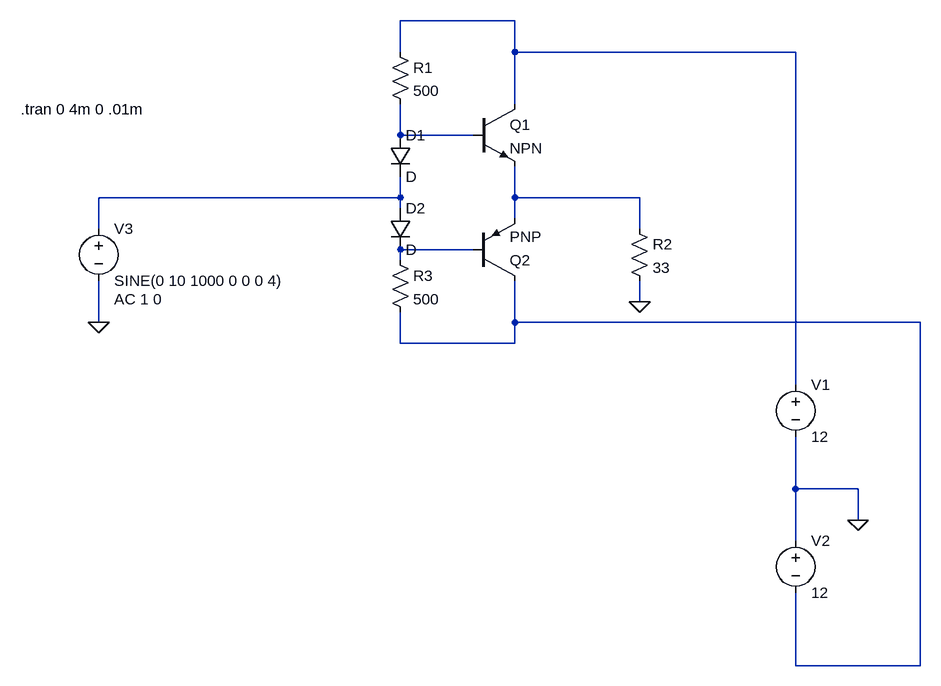
[diagram p0: schematic claseab2.asc]
claseab2.asc, the LTspice schematic file:
Version 4
SHEET 1 1360 680
WIRE 256 -560 80 -560
WIRE 80 -512 80 -560
WIRE 256 -512 256 -560
WIRE 688 -512 256 -512
WIRE 256 -432 256 -512
WIRE 80 -384 80 -432
WIRE 192 -384 80 -384
WIRE 80 -288 80 -320
WIRE 80 -288 -384 -288
WIRE 256 -288 256 -336
WIRE 448 -288 256 -288
WIRE 80 -272 80 -288
WIRE 256 -256 256 -288
WIRE -384 -240 -384 -288
WIRE 448 -240 448 -288
WIRE 192 -208 80 -208
WIRE 80 -192 80 -208
WIRE 448 -128 448 -160
WIRE -384 -96 -384 -160
WIRE 256 -96 256 -160
WIRE 880 -96 256 -96
WIRE 80 -64 80 -112
WIRE 256 -64 256 -96
WIRE 256 -64 80 -64
WIRE 688 0 688 -512
WIRE 688 160 688 80
WIRE 784 160 688 160
WIRE 784 208 784 160
WIRE 688 240 688 160
WIRE 688 432 688 320
WIRE 880 432 880 -96
WIRE 880 432 688 432
FLAG 784 208 0
FLAG -384 -96 0
FLAG 448 -128 0
SYMBOL voltage 688 -16 R0
WINDOW 123 0 0 Left 2
WINDOW 39 0 0 Left 2
SYMATTR InstName V1
SYMATTR Value 12
SYMBOL voltage 688 224 R0
WINDOW 123 0 0 Left 2
WINDOW 39 0 0 Left 2
SYMATTR InstName V2
SYMATTR Value 12
SYMBOL voltage -384 -256 R0
WINDOW 123 24 124 Left 2
WINDOW 39 0 0 Left 2
SYMATTR Value2 AC 1 0
SYMATTR InstName V3
SYMATTR Value SINE(0 10 1000 0 0 0 4)
SYMBOL diode 64 -384 R0
SYMATTR InstName D1
SYMBOL diode 64 -272 R0
SYMATTR InstName D2
SYMBOL res 432 -256 R0
SYMATTR InstName R2
SYMATTR Value 33
SYMBOL res 64 -528 R0
SYMATTR InstName R1
SYMATTR Value 500
SYMBOL res 64 -208 R0
SYMATTR InstName R3
SYMATTR Value 500
SYMBOL npn 192 -432 R0
SYMATTR InstName Q1
SYMBOL pnp 192 -160 M180
SYMATTR InstName Q2
TEXT -504 -424 Left 2 !.tran 0 4m 0 .01m

The netlist it stands for:
* claseab2.asc
V1 N001 0 12
V2 0 N006 12
V3 N003 0 SINE(0 10 1000 0 0 0 4) AC 1 0
D1 N002 N003 D
D2 N003 N005 D
R2 N004 0 33
R1 N001 N002 500
R3 N005 N006 500
Q1 N001 N002 N004 0 NPN
Q2 N006 N005 N004 0 PNP
.model D D
.lib standard.dio
.model NPN NPN
.model PNP PNP
.lib standard.bjt
.tran 0 4m 0 .01m
.backanno
.end